# Altium schematic sheet PERIPHERAL.SchDoc
size A4; SheetNumber: 4; SheetTotal: 4
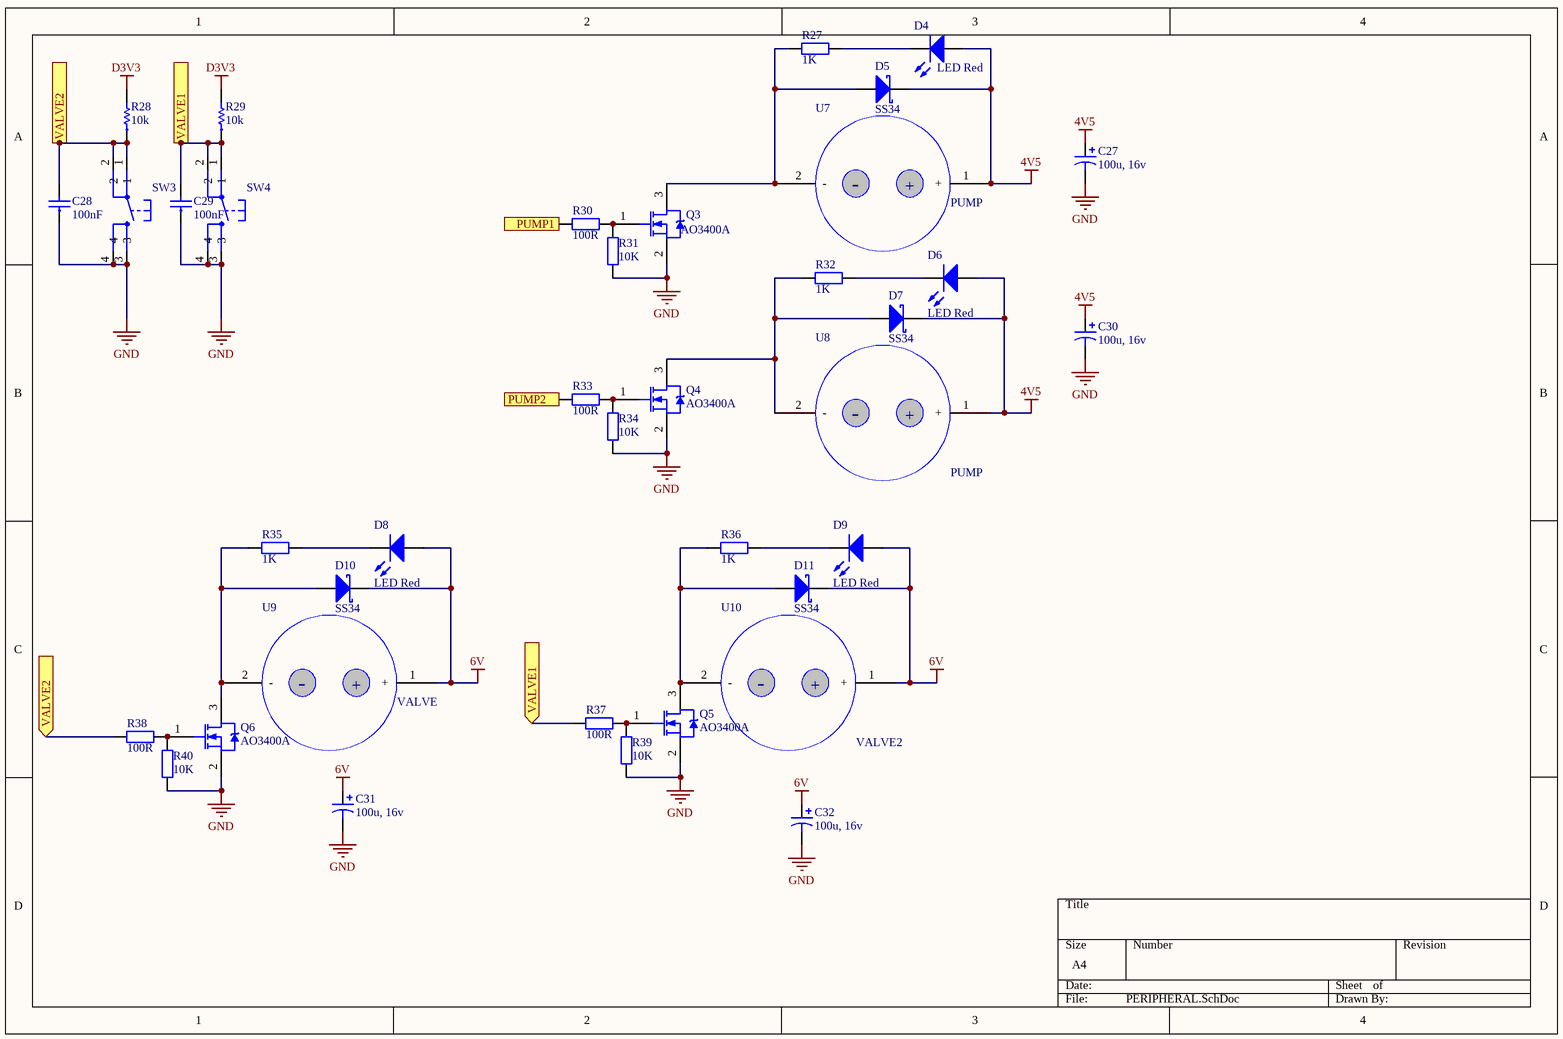
[diagram p0: PERIPHERAL.SchDoc]

## Parts
C27  value 100u, 16v  [CAP-ALU-SMD-5.5x5.5]  (hidden comment: CAP ALUM 100UF 20% 16V SMD)
C28  100nF  [CN-SMD-0603]
C29  100nF  [CN-SMD-0603]
C30  value 100u, 16v  [CAP-ALU-SMD-5.5x5.5]  (hidden comment: CAP ALUM 100UF 20% 16V SMD)
C31  value 100u, 16v  [CAP-ALU-SMD-5.5x5.5]  (hidden comment: CAP ALUM 100UF 20% 16V SMD)
C32  value 100u, 16v  [CAP-ALU-SMD-5.5x5.5]  (hidden comment: CAP ALUM 100UF 20% 16V SMD)
D4  LED Red  [LED-0805-Red]
D5  SS34  [DIO-SMD-106]
D6  LED Red  [LED-0805-Red]
D7  SS34  [DIO-SMD-106]
D8  LED Red  [LED-0805-Red]
D9  LED Red  [LED-0805-Red]
D10  SS34  [DIO-SMD-106]
D11  SS34  [DIO-SMD-106]
Q3  AO3400A  [SOT-23-3L_AOS]
Q4  AO3400A  [SOT-23-3L_AOS-L]
Q5  AO3400A  [SOT-23-3L_AOS-L]
Q6  AO3400A  [SOT-23-3L_AOS-L]
R27  value 1K  [RES-SMD-0603]  (hidden comment: RES 1K 5% 1/10W 0603)
R28  10k  [RES-SMD-0603]
R29  10k  [RES-SMD-0603]
R30  value 100R  [RES-SMD-0603]  (hidden comment: RES 100R 5% 1/10W 0603)
R31  value 10K  [RES-SMD-0603]  (hidden comment: RES 10K 5% 1/10W 0603)
R32  value 1K  [RES-SMD-0603]  (hidden comment: RES 1K 5% 1/10W 0603)
R33  value 100R  [RES-SMD-0603]  (hidden comment: RES 100R 5% 1/10W 0603)
R34  value 10K  [RES-SMD-0603]  (hidden comment: RES 10K 5% 1/10W 0603)
R35  value 1K  [RES-SMD-0603]  (hidden comment: RES 1K 5% 1/10W 0603)
R36  value 1K  [RES-SMD-0603]  (hidden comment: RES 1K 5% 1/10W 0603)
R37  value 100R  [RES-SMD-0603]  (hidden comment: RES 100R 5% 1/10W 0603)
R38  value 100R  [RES-SMD-0603]  (hidden comment: RES 100R 5% 1/10W 0603)
R39  value 10K  [RES-SMD-0603]  (hidden comment: RES 10K 5% 1/10W 0603)
R40  value 10K  [RES-SMD-0603]  (hidden comment: RES 10K 5% 1/10W 0603)
SW3  SW2  [BUTTON 4 PIN]  (value not drawn)
SW4  SW2  [BUTTON 4 PIN]  (value not drawn)
U7  PUMP  [Pump]
U8  PUMP  [Pump]
U9  VALVE  [VALVE]
U10  VALVE2  [VALVE]

## Ports
PUMP1 (in), PUMP2 (in), VALVE1 (in), VALVE2 (in)

## Nets
4V5: C27.1 C30.1 D4.1(A) D5.2(K) D6.1(A) D7.2(K) U7.1(+) U8.1(+)
6V: C31.1 C32.1 D8.1(A) D9.1(A) D10.2(K) D11.2(K) U9.1(+) U10.1(+)
D3V3: R28.2 R29.2
GND: C27.2 C28.1 C29.1 C30.2 C31.2 C32.2 Q3.2(S) Q4.2(S) Q5.2(S) Q6.2(S) R31.1 R34.1 R39.1 R40.1 SW3.3 SW3.4 SW4.3 SW4.4
PUMP1: R30.1 ; port PUMP1
PUMP2: R33.1 ; port PUMP2
VALVE1: C29.2 R29.1 R37.1 SW4.1 SW4.2 ; port VALVE1
VALVE2: C28.2 R28.1 R38.1 SW3.1 SW3.2 ; port VALVE2
NetD4_2: D4.2(K) R27.2
NetD5_1: D5.1(A) Q3.3(D) R27.1 U7.2(-)
NetD6_2: D6.2(K) R32.2
NetD7_1: D7.1(A) Q4.3(D) R32.1 U8.2(-)
NetD8_2: D8.2(K) R35.2
NetD9_2: D9.2(K) R36.2
NetD10_1: D10.1(A) Q6.3(D) R35.1 U9.2(-)
NetD11_1: D11.1(A) Q5.3(D) R36.1 U10.2(-)
NetQ3_1: Q3.1(G) R30.2 R31.2
NetQ4_1: Q4.1(G) R33.2 R34.2
NetQ5_1: Q5.1(G) R37.2 R39.2
NetQ6_1: Q6.1(G) R38.2 R40.2

## Library data of the parts
C27 C30-C32 = UWT1C101MCL1GB: Supplier 1: Digi-Key; Supplier Part Number 1: 493-2177-2-ND
C28 C29 = CAPCER0001 100nF 10% 50V X7R 0603 SMD: CAP CER 100nF 10% 50V X7R 0603 SMD; LINE: SMT; TYPE: EP; UNIT: PCS; TMG CODE: None; CERTIFICATION: NA; CLASS: B; MOUNT: SMD; TMG PN: CAPCER0001; ComponentLink1Description: Datasheet; ComponentLink1URL: https://datasheet.lcsc.com/lcsc/1811021431_Samsung-Electro-Mechanics-CL10B104KB8NNNC_C1591.pdf; Footprint: 0603
D4 D6 D8 D9 = LTST-C190KRKT: Lite-On LED Red 0603; Supplier Part Number 1: 160-1436-1-ND; Supplier 1: Digi-Key; Supplier Part Number 2: FL1413; Value: LED Red
D5 D7 D10 D11 = SS34: Schottky Diode 40V 3A SMA; Supplier 1: Digi-Key; Supplier Part Number 1: SS34-E3/57TGICT-ND; Value: SS34
Q3-Q6 = IRFML8244TRPBF: MOSFET N-CH 25V 5.8A SOT23; Supplier 1: Digi-Key; Supplier Part Number 1: IRFML8244TRPBFCT-ND; Value: AO3400A
R27 R32 R35 R36 = RC0603JR-071KL: Yageo RES 1K 5% 1/10W 0603; Supplier 1: LCSC; Supplier Part Number 1: C131707
R28 R29 = RESCHP0428 8K4 1% 0603 SMD: RES CHP 8K4 1% 1/10W 0603 SMD; LINE: SMT; UNIT: PCS; TMG CODE: None; CERTIFICATION: NA; CLASS: B; MOUNT: SMD; TYPE: EP; ComponentLink1Description: Datasheet; ComponentLink1URL: https://datasheet.lcsc.com/lcsc/2304140030_YAGEO-RT0603FRD07100RL_C160603.pdf
R30 R33 R37 R38 = RC0603JR-07100RL: Yageo RES 100R 5% 1/10W 0603; Supplier 1: Digi-Key; Supplier Part Number 1: 311-100GRCT-ND; Supplier Part Number 2: FL2438
R31 R34 R39 R40 = RC0603JR-0710KL: Yageo RES 10K 5% 1/10W 0603; Supplier 1: Digi-Key; Supplier Part Number 1: 311-10KGRCT-ND; Supplier Part Number 2: FL2403
SW3 SW4 = SW2: Switch button 4 pin
U7-U10 = A5F083: Connector Header 2 Position 6.35mm Solder Straight Thru-Hole 2 Terminal 1 Port MLX-Series; Manufacturer: Molex; Manufacturer Lifecycle Status: ACTIVE; Connector Type: Power; Contact Resistance: 3.5mΩ; Current Rating: 13.5A; Dielectric Material: Polyester; Gender: Female; Glow Wire Compliant: Non-compliant; Insulation Resistance: 1GΩ; Number of Circuits: 2; Operating Force: 6.672N; Plating: Tin; Plating Thickness: 3.5052µm; Voltage Rating: 600V; Supplier 1: Arrow Electronics; Manufacturer Part Number: 10-84-4022; RoHS: Compliant; Category: Headers and Wire Housings; Stock 1: 4724; Pricing 1: 1=0,2907, 10=0,267, 100=0,245, 500=0,229, 1836=0,216 (USD); China RoHS: Compliant; Color: Natural; Contact Gender: Female; Contact Material: Bronze; Contact Plating: Tin; Country of Origin: US; Flammability Rating: UL94 V-2; Halogen Free: Low Halogen; Housing Material: Nylon; Lead Free: Lead Free; Lifecycle Status: Production; Max Operating Temperature: 105°C; Min Operating Temperature: -55°C; Mount: Through Hole; Number of Contacts: 2; Number of Pins: 2; Number of Positions: 2; Number of Rows: 1; Orientation: Vertical; Packaging: Carton; Pitch: 6.35mm; Radiation Hardening: No; REACH SVHC: Yes; Schedule B: 8536694040, 8536694040|8536694040|8536694040|8536694040|8536694040; Shell Material: POLYAMIDE66; Terminal Pitch: 6.35mm; Termination: Solder; ComponentLink1URL: https://datasheet.octopart.com:443/10-84-4022-Molex-datasheet-137053637.pdf?src-supplier=element14+APAC; ComponentLink1Description: https://datasheet.octopart.com:443/10-84-4022-Molex-datasheet-137053637.pdf?src-supplier=element14+APAC; ComponentLink2URL: https://datasheet.octopart.com:443/10-84-4022-Molex-datasheet-13791970.pdf?src-supplier=Molex; ComponentLink2Description: https://datasheet.octopart.com:443/10-84-4022-Molex-datasheet-13791970.pdf?src-supplier=Molex; ComponentLink3URL: https://sigma.octopart.com:443/16272272/technical_drawing/Molex-10-84-4022.pdf?src-supplier=Molex; ComponentLink3Description: https://sigma.octopart.com:443/16272272/technical_drawing/Molex-10-84-4022.pdf?src-supplier=Molex; ComponentLink4URL: https://datasheet.octopart.com:443/010844022-Molex-datasheet-5390850.pdf?src-supplier=Molex; ComponentLink4Description: https://datasheet.octopart.com:443/010844022-Molex-datasheet-5390850.pdf?src-supplier=Molex; ComponentLink5URL: https://datasheet.octopart.com:443/10-84-4022-Molex-datasheet-154742841.pdf?src-supplier=Master+Electronics; ComponentLink5Description: https://datasheet.octopart.com:443/10-84-4022-Molex-datasheet-154742841.pdf?src-supplier=Master+Electronics; ComponentLink6URL: https://datasheet.octopart.com:443/10-84-4022-Molex-datasheet-33343972.pdf?src-supplier=Electro+Sonic; ComponentLink6Description: https://datasheet.octopart.com:443/10-84-4022-Molex-datasheet-33343972.pdf?src-supplier=Electro+Sonic; ComponentLink7URL: https://datasheet.octopart.com:443/10-84-4022-Molex-datasheet-21205596.pdf?src-supplier=Electro+Sonic; ComponentLink7Description: https://datasheet.octopart.com:443/10-84-4022-Molex-datasheet-21205596.pdf?src-supplier=Electro+Sonic; ComponentLink8URL: https://datasheet.octopart.com:443/10-84-4022-Molex-datasheet-62102692.pdf?src-supplier=Electro+Sonic; ComponentLink8Description: https://datasheet.octopart.com:443/10-84-4022-Molex-datasheet-62102692.pdf?src-supplier=Electro+Sonic; ComponentLink9URL: https://datasheet.octopart.com:443/10-84-4022-Molex-datasheet-140174504.pdf?src-supplier=RS+(Formerly+Allied+Electronics); ComponentLink9Description: https://datasheet.octopart.com:443/10-84-4022-Molex-datasheet-140174504.pdf?src-supplier=RS+(Formerly+Allied+Electronics); ComponentLink10URL: https://datasheet.octopart.com:443/10-84-4022-Molex-datasheet-120134962.pdf?src-supplier=RS+(Formerly+Allied+Electronics); ComponentLink10Description: https://datasheet.octopart.com:443/10-84-4022-Molex-datasheet-120134962.pdf?src-supplier=RS+(Formerly+Allied+Electronics); ComponentLink11URL: https://datasheet.octopart.com:443/10-84-4022-Molex-datasheet-32867450.pdf?src-supplier=Newark; ComponentLink11Description: https://datasheet.octopart.com:443/10-84-4022-Molex-datasheet-32867450.pdf?src-supplier=Newark; ComponentLink12URL: https://datasheet.octopart.com:443/10844022-Molex-datasheet-8320017.pdf?src-supplier=Jameco; ComponentLink12Description: https://datasheet.octopart.com:443/10844022-Molex-datasheet-8320017.pdf?src-supplier=Jameco; ComponentLink13URL: https://datasheet.octopart.com:443/10-84-4022-Molex-datasheet-5314522.pdf?src-supplier=Verical; ComponentLink13Description: https://datasheet.octopart.com:443/10-84-4022-Molex-datasheet-5314522.pdf?src-supplier=Verical; ComponentLink14URL: https://datasheet.octopart.com:443/10-84-4022-Molex-datasheet-27226.pdf?src-supplier=DigiKey; ComponentLink14Description: https://datasheet.octopart.com:443/10-84-4022-Molex-datasheet-27226.pdf?src-supplier=DigiKey; ComponentLink15URL: http://sigma.octopart.com:80/16272275/rohs_statement/Molex-10-84-4022.pdf?src-supplier=Compliance+Statements; ComponentLink15Description: http://sigma.octopart.com:80/16272275/rohs_statement/Molex-10-84-4022.pdf?src-supplier=Compliance+Statements; ComponentLink16URL: http://sigma.octopart.com:80/reach_statement/Molex-company-74.pdf?src-supplier=Compliance+Statements; ComponentLink16Description: http://sigma.octopart.com:80/reach_statement/Molex-company-74.pdf?src-supplier=Compliance+Statements; ComponentLink17URL: http://sigma.octopart.com:80/rohs_statement/Molex-company-73.pdf?src-supplier=Compliance+Statements; ComponentLink17Description: http://sigma.octopart.com:80/rohs_statement/Molex-company-73.pdf?src-supplier=Compliance+Statements; ComponentLink18URL: http://sigma.octopart.com:80/conflict_mineral_statement/Molex-company-72.pdf?src-supplier=Compliance+Statements; ComponentLink18Description: http://sigma.octopart.com:80/conflict_mineral_statement/Molex-company-72.pdf?src-supplier=Compliance+Statements; Supplier Part Number 1: 0010844022